# Altium schematic sheet Sensors.SchDoc
size A4
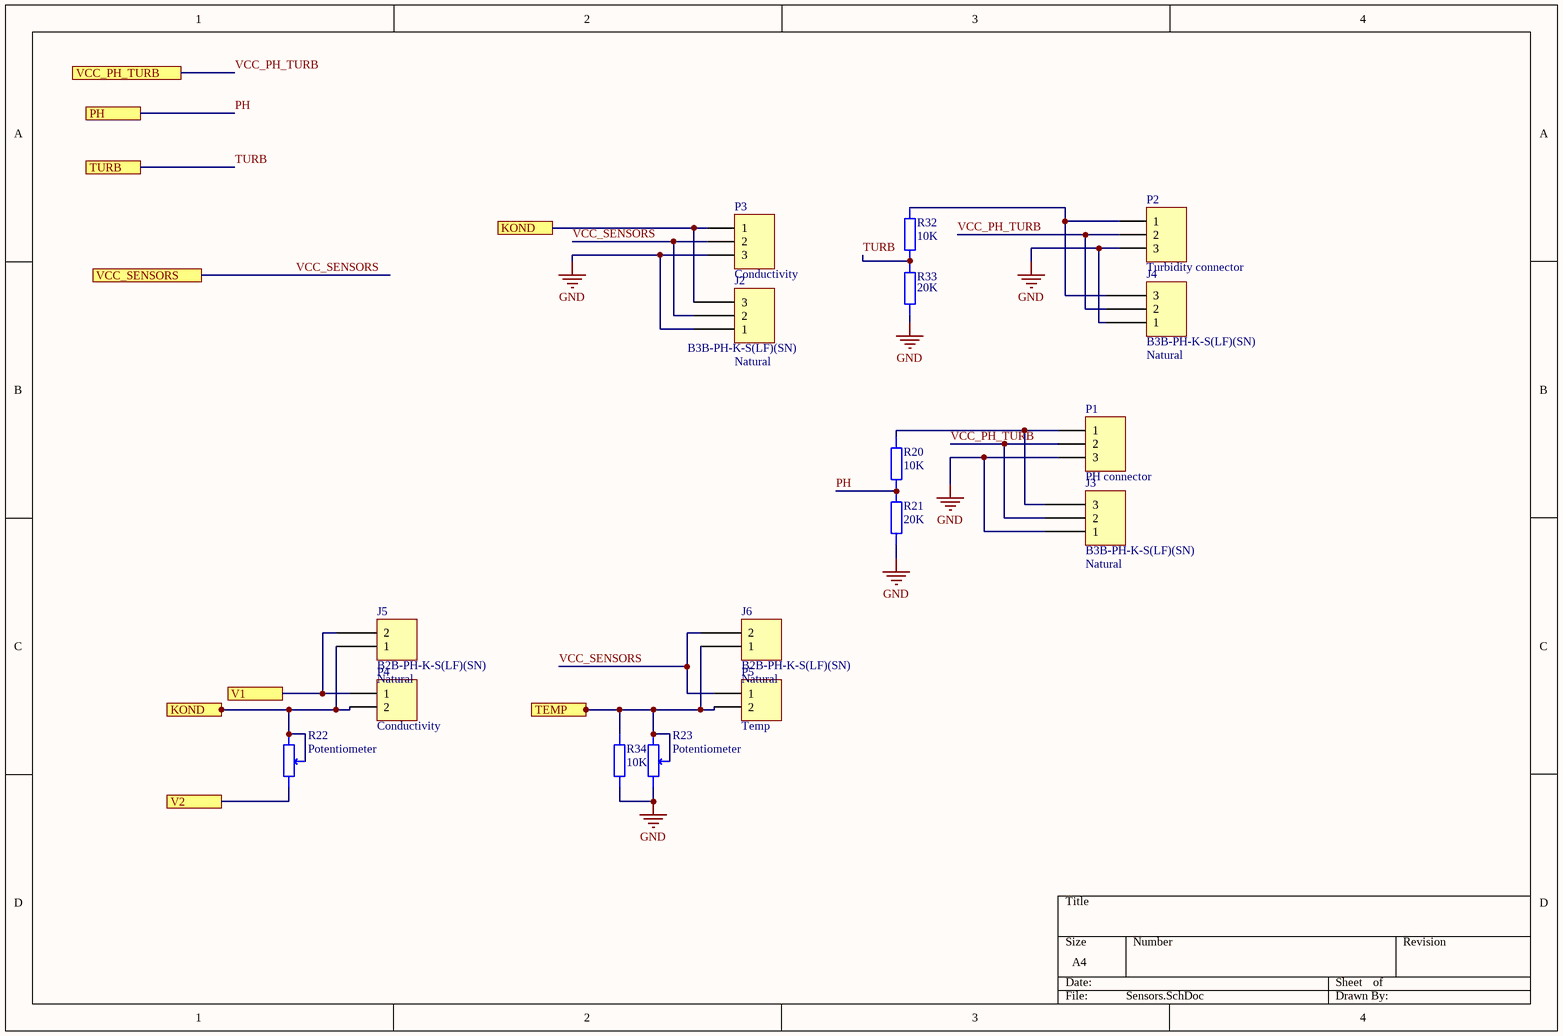
[diagram p0: Sensors.SchDoc]

## Parts
J2  B3B-PH-K-S(LF)(SN)  Colour: Natural  [JST B3B-PH-K]
J3  B3B-PH-K-S(LF)(SN)  Colour: Natural  [JST B3B-PH-K]
J4  B3B-PH-K-S(LF)(SN)  Colour: Natural  [JST B3B-PH-K]
J5  B2B-PH-K-S(LF)(SN)  Colour: Natural  [JST B2B-PH-K]
J6  B2B-PH-K-S(LF)(SN)  Colour: Natural  [JST B2B-PH-K]
P1  PH connector  [HDR1X3]
P2  Turbidity connector  [HDR1X3]
P3  Conductivity  [HDR1X3]
P4  Conductivity  [HDR1X2]
P5  Temp  [HDR1X2]
R20  value 10K  [6-0805_L]  (hidden comment: Resistor)
R21  value 20K  [6-0805_L]  (hidden comment: Resistor)
R22  Potentiometer  [Trimmer]
R23  Potentiometer  [Trimmer]
R32  value 10K  [6-0805_L]  (hidden comment: Resistor)
R33  value 20K  [6-0805_L]  (hidden comment: Resistor)
R34  value 10K  [6-0805_L]  (hidden comment: Resistor)

## Ports
KOND, PH, TEMP, TURB, V1, V2, VCC_PH_TURB, VCC_SENSORS

## Nets
GND: J2.1 J3.1 J4.1 P1.3 P2.3 P3.3 R21.2 R23.2 R33.2 R34.2
KOND: J2.3 J5.1 P3.1 P4.2 R22.1 R22.3 ; port KOND
PH: R20.2 R21.1 ; port PH
TEMP: J6.1 P5.2 R23.1 R23.3 R34.1 ; port TEMP
TURB: R32.2 R33.1 ; port TURB
V1: J5.2 P4.1 ; port V1
V2: R22.2 ; port V2
VCC_PH_TURB: J3.2 J4.2 P1.2 P2.2 ; port VCC_PH_TURB
VCC_SENSORS: J2.2 J6.2 P3.2 P5.1 ; port VCC_SENSORS
NetJ3_3: J3.3 P1.1 R20.1
NetJ4_3: J4.3 P2.1 R32.1

## Library data of the parts
J2-J4 = B3B-PH-K-S(LF)(SN): CONN HEADER PH TOP 3POS 2MM; Manufacturer: JST Sales America Inc.; Pitch: 0.079" (2.00mm); Number Of Positions: 3; Part Number: B3B-PH-K-S(LF)(SN); PartId: 29448; Supplier 1: Digi-Key; Supplier Part Number 1: 455-1705-ND; ComponentLink1Description: Datasheet; ComponentLink1URL: http://www.jst-mfg.com/product/pdf/eng/ePH.pdf; ComponentLink2Description: Digi-Key Listing; ComponentLink2URL: http://www.digikey.com/product-detail/en/jst-sales-america-inc/B3B-PH-K-S(LF)(SN)/455-1705-ND/926612; Price: 0,19; Type: Header, Shrouded; Contact Finish: Tin; Fastening Type: Detent Lock; Number Of Rows: 1; Series: PH
J5 J6 = B2B-PH-K-S(LF)(SN): CONN HEADER PH TOP 2POS 2MM; Manufacturer: JST Sales America Inc.; Pitch: 0.079" (2.00mm); Number Of Positions: 2; Part Number: B2B-PH-K-S(LF)(SN); PartId: 29447; Supplier 1: Digi-Key; Supplier Part Number 1: 455-1704-ND; ComponentLink1Description: Datasheet; ComponentLink1URL: http://www.jst-mfg.com/product/pdf/eng/ePH.pdf; ComponentLink2Description: Digi-Key Listing; ComponentLink2URL: http://www.digikey.com/product-detail/en/jst-sales-america-inc/B2B-PH-K-S(LF)(SN)/455-1704-ND/926611; Price: 0,17; Type: Header, Shrouded; Contact Finish: Tin; Fastening Type: Detent Lock; Number Of Rows: 1; Series: PH
P1-P3 = Header 3: Header, 3-Pin; LatestRevisionDate: 17-Jul-2002; LatestRevisionNote: Re-released for DXP Platform.; Publisher: Altium Limited
P4 P5 = Header 2: Header, 2-Pin; LatestRevisionDate: 17-Jul-2002; LatestRevisionNote: Re-released for DXP Platform.; Publisher: Altium Limited
R20 R21 R32-R34 = Resistor: Tolerance: 1%; Power Rating: 1/4W; Package: 0602